# Altium schematic sheet top_overview.SchDoc
size 297 x 209 mm; DrawnBy: Supun; Engineer: Supun; Organization: C3
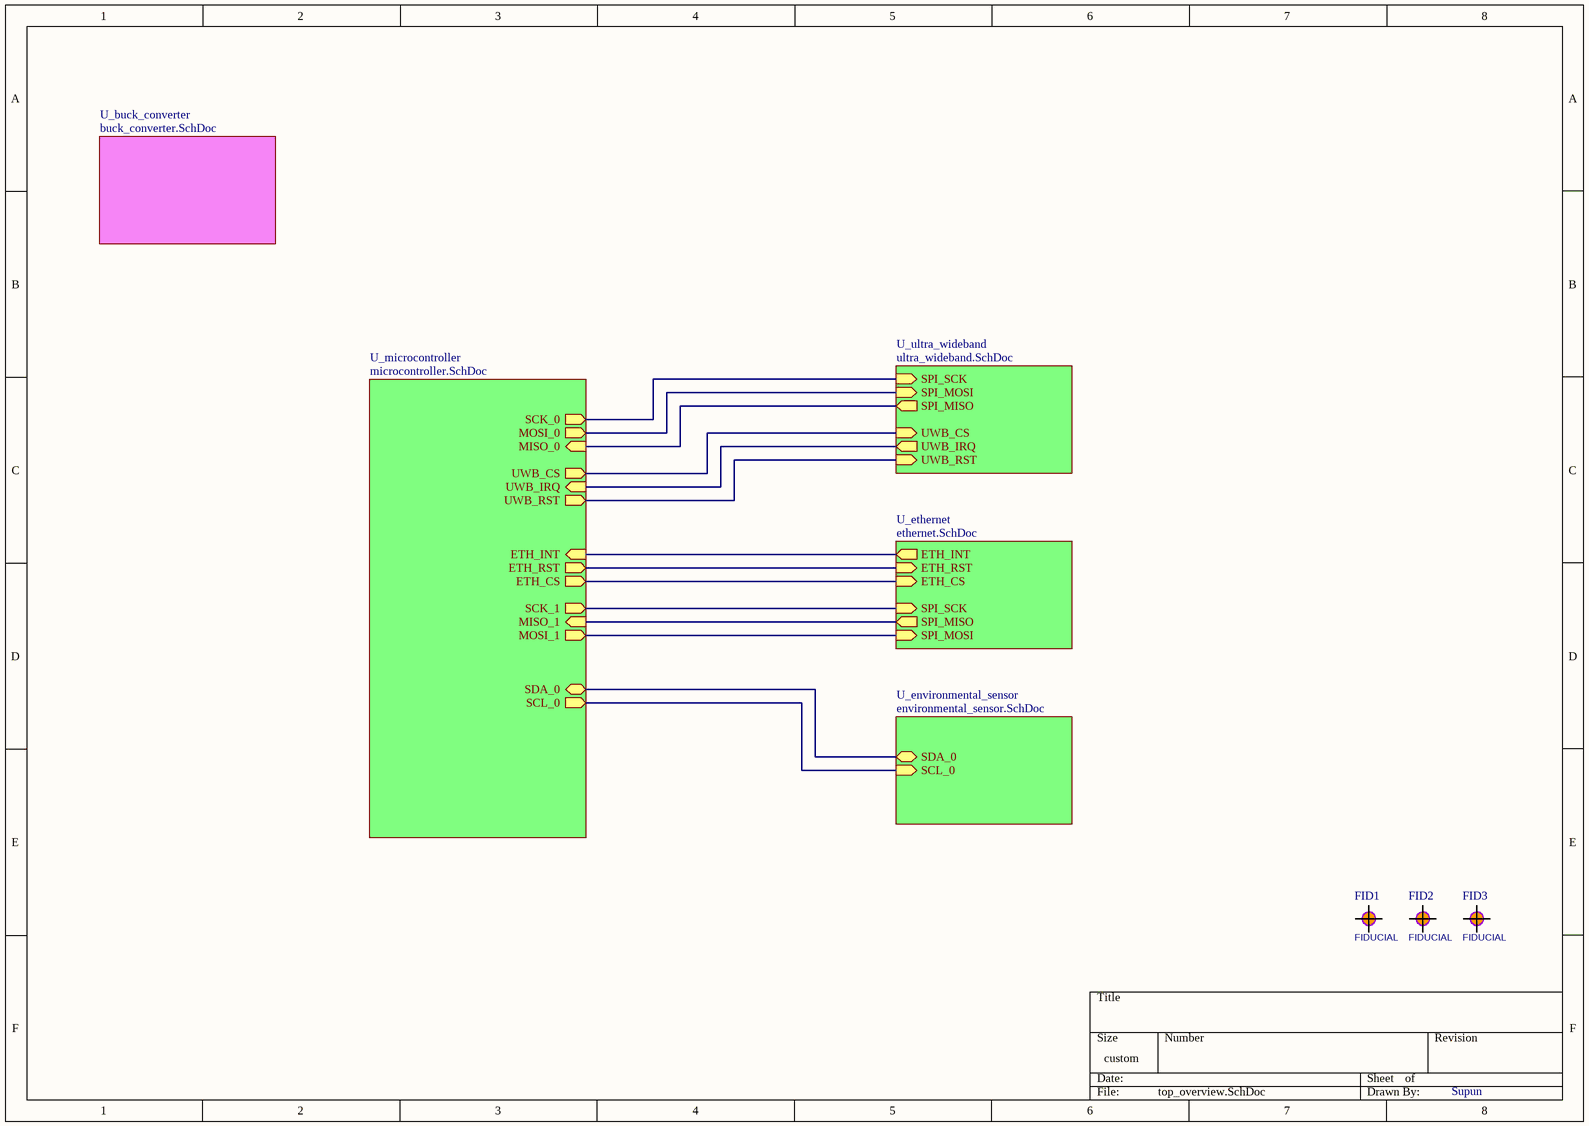
[diagram p0: top_overview.SchDoc]

## Parts
FID1  FIDUCIAL  [FIDUCIAL1SM2]  (no BOM)
FID2  FIDUCIAL  [FIDUCIAL1SM2]  (no BOM)
FID3  FIDUCIAL  [FIDUCIAL1SM2]  (no BOM)

## Sub-sheets
U_buck_converter = buck_converter.SchDoc: no entries
U_environmental_sensor = environmental_sensor.SchDoc: SDA_0 (bidir), SCL_0 (in)
U_ethernet = ethernet.SchDoc: ETH_INT (out), SPI_MISO (out), SPI_MOSI (in), ETH_RST (in), ETH_CS (in), SPI_SCK (in)
U_microcontroller = microcontroller.SchDoc: MISO_1 (in), MOSI_1 (out), SCK_1 (out), MOSI_0 (out), UWB_CS (out), SCK_0 (out), UWB_IRQ (in), UWB_RST (out), MISO_0 (in), ETH_INT (in), ETH_RST (out), SDA_0 (bidir), SCL_0 (out), ETH_CS (out)
U_ultra_wideband = ultra_wideband.SchDoc: SPI_MISO (out), UWB_IRQ (out), UWB_RST (in), UWB_CS (in), SPI_SCK (in), SPI_MOSI (in)

## Nets
(unnamed): sheet U_microcontroller/MISO_1, sheet U_ethernet/SPI_MISO
(unnamed): sheet U_microcontroller/MOSI_1, sheet U_ethernet/SPI_MOSI
(unnamed): sheet U_microcontroller/SCK_1, sheet U_ethernet/SPI_SCK
(unnamed): sheet U_microcontroller/MOSI_0, sheet U_ultra_wideband/SPI_MOSI
(unnamed): sheet U_microcontroller/UWB_CS, sheet U_ultra_wideband/UWB_CS
(unnamed): sheet U_microcontroller/SCK_0, sheet U_ultra_wideband/SPI_SCK
(unnamed): sheet U_microcontroller/UWB_IRQ, sheet U_ultra_wideband/UWB_IRQ
(unnamed): sheet U_microcontroller/UWB_RST, sheet U_ultra_wideband/UWB_RST
(unnamed): sheet U_microcontroller/MISO_0, sheet U_ultra_wideband/SPI_MISO
(unnamed): sheet U_microcontroller/ETH_INT, sheet U_ethernet/ETH_INT
(unnamed): sheet U_microcontroller/ETH_RST, sheet U_ethernet/ETH_RST
(unnamed): sheet U_microcontroller/SDA_0, sheet U_environmental_sensor/SDA_0
(unnamed): sheet U_microcontroller/SCL_0, sheet U_environmental_sensor/SCL_0
(unnamed): sheet U_microcontroller/ETH_CS, sheet U_ethernet/ETH_CS

## Notes on the sheet
- Title
- Size:
- Date:
- A4
- Number:
- Time:
- Revision:
- Sheet
- of
- File:

## Library data of the parts
FID1-FID3 = Fiducial: FIDUCIAL PCB ASSEMBLY AUTOMATED SMT; MF: SAH; ASSEMBLY: DNP; VALUE: FIDUCIAL